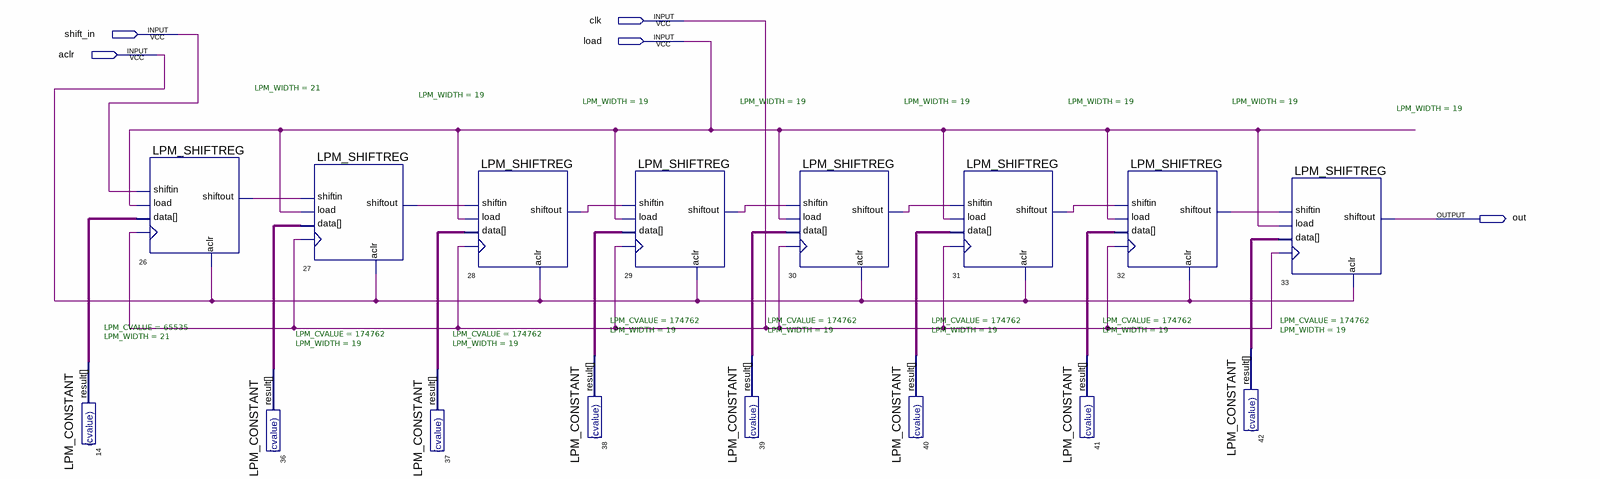
[diagram p0: schematic sheet]
// Quartus schematic data8_28sep.bdf as structural Verilog: 16 symbols, 5 pins
module data8_28sep (
  input  clk,
  input  shift_in,
  input  load,
  input  aclr,
  output out
);

  wire n26_shiftout, n27_shiftout, n28_shiftout, n29_shiftout, n30_shiftout, n31_shiftout, n32_shiftout;
  wire [18:0] n36_result, n37_result, n38_result, n39_result, n40_result, n41_result, n42_result;
  wire [20:0] n14_result;

  LPM_CONSTANT #(.LPM_CVALUE(65535), .LPM_WIDTH(21)) u_14 (.result(n14_result));
  LPM_SHIFTREG #(.LPM_WIDTH(21)) u_26 (
    .shiftin(shift_in), .clock(clk), .data(n14_result), .load(load), .aclr(aclr), .shiftout(n26_shiftout));
  LPM_CONSTANT #(.LPM_CVALUE(174762), .LPM_WIDTH(19)) u_36 (.result(n36_result));
  LPM_SHIFTREG #(.LPM_WIDTH(19)) u_27 (
    .shiftin(n26_shiftout), .clock(clk), .data(n36_result), .load(load), .aclr(aclr), .shiftout(n27_shiftout));
  LPM_CONSTANT #(.LPM_CVALUE(174762), .LPM_WIDTH(19)) u_37 (.result(n37_result));
  LPM_SHIFTREG #(.LPM_WIDTH(19)) u_28 (
    .shiftin(n27_shiftout), .clock(clk), .data(n37_result), .load(load), .aclr(aclr), .shiftout(n28_shiftout));
  LPM_CONSTANT #(.LPM_CVALUE(174762), .LPM_WIDTH(19)) u_38 (.result(n38_result));
  LPM_SHIFTREG #(.LPM_WIDTH(19)) u_29 (
    .shiftin(n28_shiftout), .clock(clk), .data(n38_result), .load(load), .aclr(aclr), .shiftout(n29_shiftout));
  LPM_CONSTANT #(.LPM_CVALUE(174762), .LPM_WIDTH(19)) u_39 (.result(n39_result));
  LPM_SHIFTREG #(.LPM_WIDTH(19)) u_30 (
    .shiftin(n29_shiftout), .clock(clk), .data(n39_result), .load(load), .aclr(aclr), .shiftout(n30_shiftout));
  LPM_CONSTANT #(.LPM_CVALUE(174762), .LPM_WIDTH(19)) u_40 (.result(n40_result));
  LPM_SHIFTREG #(.LPM_WIDTH(19)) u_31 (
    .shiftin(n30_shiftout), .clock(clk), .data(n40_result), .load(load), .aclr(aclr), .shiftout(n31_shiftout));
  LPM_CONSTANT #(.LPM_CVALUE(174762), .LPM_WIDTH(19)) u_41 (.result(n41_result));
  LPM_SHIFTREG #(.LPM_WIDTH(19)) u_32 (
    .shiftin(n31_shiftout), .clock(clk), .data(n41_result), .load(load), .aclr(aclr), .shiftout(n32_shiftout));
  LPM_CONSTANT #(.LPM_CVALUE(174762), .LPM_WIDTH(19)) u_42 (.result(n42_result));
  LPM_SHIFTREG #(.LPM_WIDTH(19)) u_33 (
    .shiftin(n32_shiftout), .clock(clk), .data(n42_result), .load(load), .aclr(aclr), .shiftout(out));
endmodule
